# Altium project Board3.PrjPcb
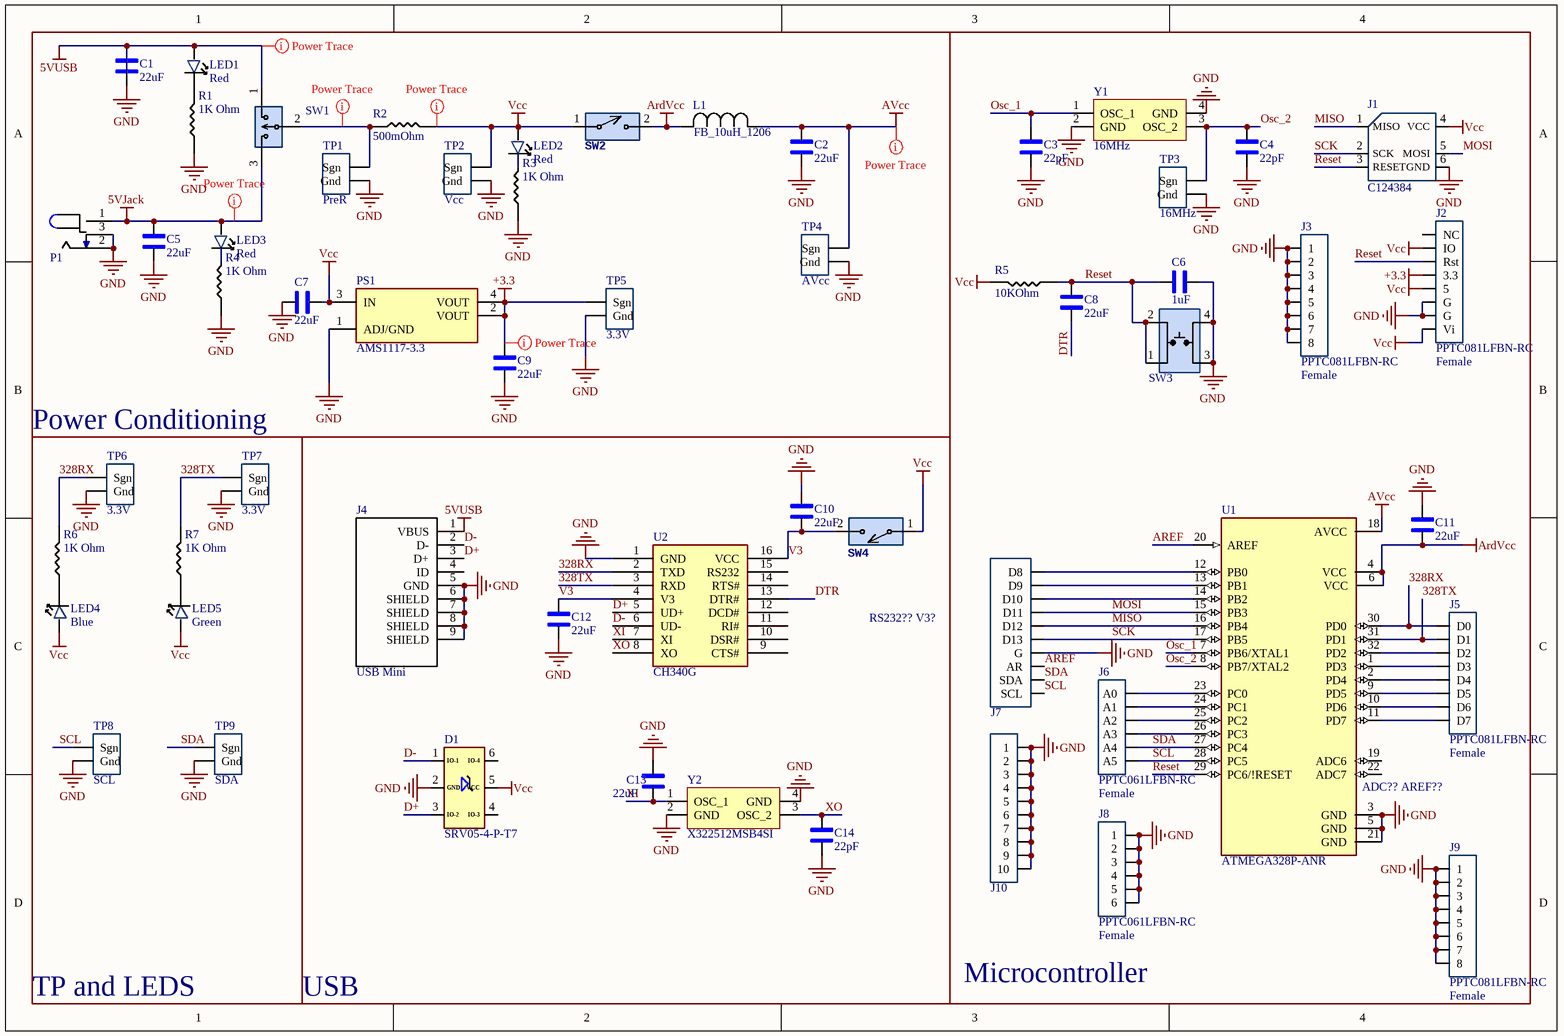
[diagram p0: Board3.SchDoc]
1 sheet, 57 parts. Net scope: global (net labels, ports and power ports of the same name join across sheets).
Board file: Board3.PcbDoc

## Sheet Board3.SchDoc
size A4; SheetNumber: 1; SheetTotal: 1

### Parts
C1  22uF  [1206_Passive_Capacitor]
C2  22uF  [1206_Passive_Capacitor]
C3  22pF  [1206_Passive_Capacitor]
C4  22pF  [1206_Passive_Capacitor]
C5  22uF  [1206_Passive_Capacitor]
C6  1uF  [1206_Passive_Capacitor]
C7  22uF  [1206_Passive_Capacitor]
C8  22uF  [1206_Passive_Capacitor]
C9  22uF  [1206_Passive_Capacitor]
C10  22uF  [1206_Passive_Capacitor]
C11  22uF  [1206_Passive_Capacitor]
C12  22uF  [1206_Passive_Capacitor]
C13  22uF  [1206_Passive_Capacitor]
C14  22pF  [1206_Passive_Capacitor]
D1  SRV05-4-P-T7  [TVS]
J1  LCSC Part#: C124384  [ICSP]  (hidden comment: NRPN032PAEN-RC)
J2  PPTC081LFBN-RC  value Female  [8_PIN_ARD-PWR_100MIL]
J3  PPTC081LFBN-RC  value Female  [8_PIN_100MIL - Female]
J4  USB Mini  [USB_MINI_B]
J5  PPTC081LFBN-RC  value Female  [8_PIN_ARD-DIG_100MIL]
J6  PPTC061LFBN-RC  value Female  [6_PIN_ARD-Analog_100mil]
J7  PPTC101LFBN-RC  [10_PIN_ARDUINO_100MIL]  (value not drawn)
J8  PPTC061LFBN-RC  value Female  [6_PIN_100MIL -Female]
J9  PPTC081LFBN-RC  value Female  [8_PIN_100MIL - Female]
J10  PPTC101LFBN-RC  [10_PIN_100MIL - Female]  (value not drawn)
L1  FB_10uH_1206  [AIML-1206_ABR-M]
LED1  Red  [LED_1206]
LED2  Red  [LED_1206]
LED3  Red  [LED_1206]
LED4  Blue  [LED_1206]
LED5  Green  [LED_1206]
P1  Power Jack  [Power_Jack]  (value not drawn)
PS1  AMS1117-3.3  [LDO]
R1  value 1K Ohm  [1206_Passive_Resitor]  (hidden comment: 1k)
R2  value 500mOhm  [1206_Passive_Resitor]  (hidden comment: 500m)
R3  value 1K Ohm  [1206_Passive_Resitor]  (hidden comment: 1k)
R4  value 1K Ohm  [1206_Passive_Resitor]  (hidden comment: 1k)
R5  value 10KOhm  [1206_Passive_Resitor]  (hidden comment: 10k)
R6  value 1K Ohm  [1206_Passive_Resitor]  (hidden comment: 1k)
R7  value 1K Ohm  [1206_Passive_Resitor]  (hidden comment: 1k)
SW1  PREC003SAAN-RC  [3_PIN_100mil]  (value not drawn)
SW2  SW_2Pin_100mil_Switch  [2Pin-Header-Conn]  (value not drawn)
SW3  TL3305AF160QG  [Switch_JLC]  (value not drawn)
SW4  SW_2Pin_100mil_Switch  [2Pin-Header-Conn]  (value not drawn)
TP1  PreR  [TP10x_Probe]
TP2  Vcc  [TP10x_Probe]
TP3  16MHz  [TP10x_Probe]
TP4  AVcc  [TP10x_Probe]
TP5  3.3V  [TP10x_Probe]
TP6  3.3V  [TP10x_Probe]
TP7  3.3V  [TP10x_Probe]
TP8  SCL  [TP10x_Probe]
TP9  SDA  [TP10x_Probe]
U1  ATMEGA328P-ANR  [ATMega328P]
U2  CH340G  [USB to serial]
Y1  value 16MHz  [Crystal resonator]  (hidden comment: X322516MLB4SI)
Y2  X322512MSB4SI  [Crystal resonator]

### Blocks framed on the sheet
Power Conditioning: C1 C2 C5 C7 C9 L1 LED1-LED3 P1 PS1 R1-R4 SW1 SW2 TP1 TP2 TP4 TP5
Microcontroller: C3 C4 C6 C8 C11 J1-J3 J5-J10 R5 SW3 TP3 U1 Y1
TP and LEDS: LED4 LED5 R6 R7 TP6-TP9
USB: C10 C12-C14 D1 J4 SW4 U2 Y2

### Nets
5VJack: C5.2 LED3.1 P1.1 SW1.3
5VUSB: C1.1 J4.1(VBUS) LED1.1 SW1.1
+3.3: C9.2 J2.4(3.3) PS1.2(VOUT) PS1.4(VOUT) TP5.1(Sgn)
ArdVcc: C11.2 L1.2 SW2.2 U1.4(VCC) U1.6(VCC)
AVcc: C2.2 L1.1 TP4.1(Sgn) U1.18(AVCC)
GND: C1.2 C2.1 C3.1 C4.1 C5.1 C6.1 C7.1 C9.1 C10.1 C11.1 C12.1 C13.2 C14.1 D1.2(GND) J1.6(GND) J2.6(G) J2.7(G) J3.1 J3.2 J3.3 J3.4 J3.5 J3.6 J3.7 J3.8 J4.5(GND) J4.6(SHIELD) J4.7(SHIELD) J4.8(SHIELD) J4.9(SHIELD) J7.4(G) J8.1 J8.2 J8.3 J8.4 J8.5 J8.6 J9.1 J9.2 J9.3 J9.4 J9.5 J9.6 J9.7 J9.8 J10.1 J10.2 J10.3 J10.4 J10.5 J10.6 J10.7 J10.8 J10.9 J10.10 P1.2 P1.3 PS1.1(ADJ/GND) R1.1 R3.1 R4.1 SW3.3 SW3.4 TP1.2(Gnd) TP2.2(Gnd) TP3.2(Gnd) TP4.2(Gnd) TP5.2(Gnd) TP6.2(Gnd) TP7.2(Gnd) TP8.2(Gnd) TP9.2(Gnd) U1.3(GND) U1.5(GND) U1.21(GND) U2.1(GND) Y1.2(GND) Y1.4(GND) Y2.2(GND) Y2.4(GND)
Vcc: C7.2 D1.5(VCC) J1.4(VCC) J2.2(IO) J2.5 J2.8(Vi) LED2.1 LED4.1 LED5.1 PS1.3(IN) R2.2 R5.2 SW2.1 SW4.1 TP2.1(Sgn)
328RX: J5.8(D0) R6.2 TP6.1(Sgn) U1.30(PD0) U2.2(TXD)
328TX: J5.7(D1) R7.2 TP7.1(Sgn) U1.31(PD1) U2.3(RXD)
AREF: J7.3(AR) U1.20(AREF)
D+: D1.3(IO-2) J4.3(D+) U2.5(UD+)
D-: D1.1(IO-1) J4.2(D-) U2.6(UD-)
DTR: C8.2 U2.13(DTR#)
MISO: J1.1(MISO) J7.6(D12) U1.16(PB4)
MOSI: J1.5(MOSI) J7.7(D11) U1.15(PB3)
Osc_1: C3.2 U1.7(PB6/XTAL1) Y1.1(OSC_1)
Osc_2: C4.2 TP3.1(Sgn) U1.8(PB7/XTAL2) Y1.3(OSC_2)
Reset: C6.2 C8.1 J1.3(RESET) J2.3(Rst) R5.1 SW3.1 SW3.2 U1.29(PC6/!RESET)
SCK: J1.2(SCK) J7.5(D13) U1.17(PB5)
SCL: J6.6(A5) J7.1(SCL) TP8.1(Sgn) U1.28(PC5)
SDA: J6.5(A4) J7.2(SDA) TP9.1(Sgn) U1.27(PC4)
V3: C10.2 C12.2 SW4.2 U2.4(V3) U2.16(VCC)
XI: C13.1 U2.7(XI) Y2.1(OSC_1)
XO: C14.2 U2.8(XO) Y2.3(OSC_2)
NetJ5_1: J5.1(D7) U1.11(PD7)
NetJ5_2: J5.2(D6) U1.10(PD6)
NetJ5_3: J5.3(D5) U1.9(PD5)
NetJ5_4: J5.4(D4) U1.2(PD4)
NetJ5_5: J5.5(D3) U1.1(PD3)
NetJ5_6: J5.6(D2) U1.32(PD2)
NetJ6_1: J6.1(A0) U1.23(PC0)
NetJ6_2: J6.2(A1) U1.24(PC1)
NetJ6_3: J6.3(A2) U1.25(PC2)
NetJ6_4: J6.4(A3) U1.26(PC3)
NetJ7_8: J7.8(D10) U1.14(PB2)
NetJ7_9: J7.9(D9) U1.13(PB1)
NetJ7_10: J7.10(D8) U1.12(PB0)
NetLED1_2: LED1.2 R1.2
NetLED2_2: LED2.2 R3.2
NetLED3_2: LED3.2 R4.2
NetLED4_2: LED4.2 R6.1
NetLED5_2: LED5.2 R7.1
NetR2_1: R2.1 SW1.2 TP1.1(Sgn)

Not connected (* = marked no-connect by the designer): D1 4(IO-3) 6(IO-4); J2 1(NC); J4 4(ID); U1 19(ADC6) 22(ADC7); U2 9(CTS#) 10(DSR#) 11(RI#) 12(DCD#) 14(RTS#) 15(RS232)

### Layout directives
rule Width Constraint [Pref Width = 20mil    Min Width = 10mil    Max Width = 100mil]: 5VJack, 5VUSB, +3.3, AVcc, NetR2_1, Vcc

### Notes on the sheet
- RS232?? V3?
- (near U1) ADC?? AREF??

### Library data of the parts
C1 C2 C5 C7-C13 = C_22uF_1206: 22uF ±10% 25V X5R 1206 Multilayer Ceramic Capacitors MLCC - SMD/SMT RoHS; MFR Part #: CL31A226KAHNNNE; Type: basic; LCSC Part#: C12891; Datasheet: https://datasheet.lcsc.com/lcsc/1811031514_Samsung-Electro-Mechanics-CL31A226KAHNNNE_C12891.pdf; Value: 22uF
C3 C4 C14 = C_22pF_1206: 22pF ±5% 1kV C0G 1206 Multilayer Ceramic Capacitors MLCC - SMD/SMT RoHS; MFR Part #: 1206CG220J102NT; Type: Extended; LCSC Part#: C313096; Datasheet: https://datasheet.lcsc.com/lcsc/1810311150_FH-Guangdong-Fenghua-Advanced-Tech-1206CG220J102NT_C313096.pdf; Value: 22pF
C6 = C_1uF_1206: MULTILAYER CERAMIC CAPACITORS MLCC - SMD/SMT 1UF 50V 1206 ROHS; MFR Part #: CL31B105KBHNNNE; Type: Basic; Digikey Link: https://www.digikey.com/product-detail/en/C1206C105M4RACTU/399-8150-1-ND/3471873/?itemSeq=304982366; LCSC Part#: C1848; Value: 1uF
D1 = D_TVS_Diode: TVS SOT-23-6 ROHS; Value: TVS DIODE 5.5V 6TSOP; Type: Basic; MFR Part #: SRV05-4-P-T7; LCSC Part#: C85364; Datasheet: https://datasheet.lcsc.com/szlcsc/ProTek-Devices-SRV05-4-P-T7_C85364.pdf
J1 = J_ICSP: Connector Header Through Hole 6 position 0.079" (2.00mm); Digikey Link: https://www.digikey.com/product-detail/en/NRPN032PAEN-RC/S5801-03-ND/804955/?itemSeq=304982355; MFR Part #: NRPN032PAEN-RC; Type: Extended
J2 = JF_8_PIN_FEMALE_ARD-Pwr: 8 Position Header Connector 0.100" (2.54mm) Through Hole Tin; Digikey Link: https://www.digikey.com/product-detail/en/PPTC081LFBN-RC/S7006-ND/810147/?itemSeq=304982354; MFR Part #: PPTC081LFBN-RC; Type: Extended; LCSC Part#: C27438
J3 J9 = JF_8_PIN_FEMALE: 8 Position Header Connector 0.100" (2.54mm) Through Hole Tin; Digikey Link: https://www.digikey.com/product-detail/en/PPTC081LFBN-RC/S7006-ND/810147/?itemSeq=304982354; MFR Part #: PPTC081LFBN-RC; Type: Extended; LCSC Part#: C27438
J4 = J_USB_B_Mini: Through Hole USB Connectors RoHS; MFR Part #: 920-462A2021D10102; Value: USB mini B; LCSC Part#: C46398; Datasheet: https://datasheet.lcsc.com/szlcsc/2103081233_Jing-Extension-of-the-Electronic-Co-920-462A2021D10102_C46398.pdf; Type: Extended
J5 = JF_8_PIN_FEMALE_ARD-Dig: 8 Position Header Connector 0.100" (2.54mm) Through Hole Tin; Digikey Link: https://www.digikey.com/product-detail/en/PPTC081LFBN-RC/S7006-ND/810147/?itemSeq=304982354; MFR Part #: PPTC081LFBN-RC; Type: Extended; LCSC Part#: C27438
J6 = JF_6_PIN_FEMALE_ARD-Anolog: 6 Position Header Connector 0.100" (2.54mm) Through Hole Tin; Digikey Link: https://www.digikey.com/product-detail/en/PPTC061LFBN-RC/S7004-ND/810145/?itemSeq=304982353; MFR Part #: PPTC061LFBN-RC; LCSC Part#: C40877; Type: Extended
J7 = JF_10_PIN_FEMALE_ARDUINO: 10 Position Header Connector 0.100" (2.54mm) Through Hole Tin; Value: Female; Digikey Link: https://www.digikey.com/product-detail/en/PPTC101LFBN-RC/S7008-ND/810149/?itemSeq=304982352; MFR Part #: PPTC101LFBN-RC; LCSC Part#: C225507; Type: Extended
J8 = JF_6_PIN_FEMALE: 6 Position Header Connector 0.100" (2.54mm) Through Hole Tin; Digikey Link: https://www.digikey.com/product-detail/en/PPTC061LFBN-RC/S7004-ND/810145/?itemSeq=304982353; MFR Part #: PPTC061LFBN-RC; LCSC Part#: C40877; Type: Extended
J10 = JF_10_PIN_FEMALE_: 10 Position Header Connector 0.100" (2.54mm) Through Hole Tin; Value: Female; Digikey Link: https://www.digikey.com/product-detail/en/PPTC101LFBN-RC/S7008-ND/810149/?itemSeq=304982352; MFR Part #: PPTC101LFBN-RC; LCSC Part#: C225507; Type: Extended
L1 = FB_10uH_1206: 25mA 10uH ±10% 800mΩ 1206  Inductors (SMD) ROHS; Mfr_Name: FH (Guangdong Fenghua Advanced Tech); MFR PART #: CMI321609X100KT; Type: Basic; LCSC PART#: C1051; DataSheet: https://datasheet.lcsc.com/lcsc/1810311314_FH--Guangdong-Fenghua-Advanced-Tech-CMI321609X100KT_C1051.pdf
LED1-LED3 = LED_RED_1206: Red 621~631nm 1206 Light Emitting Diodes (LED) RoHS; MFR Part #: 15-21/R6C-FQ1R1B/2T; Type: Extended; LCSC Part#: C93133; Datasheet: https://datasheet.lcsc.com/szlcsc/1811151241_Everlight-Elec-15-21-R6C-FQ1R1B-2T_C93133.pdf; Value: Red
LED4 = LED_BLUE_1206: blue 1206  Light Emitting Diodes (LED) ROHS; MFR Part #: NCD1206B1; Type: Extended; LCSC Part#: C130717; Datasheet: https://datasheet.lcsc.com/lcsc/2008201033_Foshan-NationStar-Optoelectronics-NCD1206B1_C130717.pdf; Value: Blue
LED5 = LED_GREEN_1206: Green 513~528nm 1206 Light Emitting Diodes (LED) RoHS; MFR Part #: SZYY1206G; Type: Extended; LCSC Part#: C434439; Datasheet: https://datasheet.lcsc.com/lcsc/2006301532_Yongyu-Photoelectric-SZYY1206G_C434439.pdf; Value: Green
P1 = P_Power Jack: Power Barrel Connector Jack 2.10mm ID (0.083"), 5.50mm OD (0.217") Through Hole, Right Angle; MFR Part #: PJ-102A; Value: CONN PWR JACK 2X5.5MM SOLDER; Digikey Link: https://www.digikey.com/product-detail/en/PJ-102A/CP-102A-ND/275425/?itemSeq=304982367; LCSC Part#: C136744; Type: Extended
PS1 = PS_AMS_LDO_3v3: LOW DROPOUT REGULATORS(LDO) POSITIVE FIXED 1.3V @ 800MA 15V 3.3V 1A SOT-223 ROHS; Value: IC REG LINEAR 3.3V 800MA SOT223; MFR Part #: AMS1117-3.3; LCSC Part#: C6186; Type: Basic
R1 R3 R4 R6 R7 = R_1K_1206: CHIP RESISTOR - SURFACE MOUNT 1KOHMS ±1% 1/4W 1206 ROHS; MFR Part #: RNCP1206FTD1K00CT; Digikey Link: https://www.digikey.com/product-detail/en/RNCP1206FTD1K00/RNCP1206FTD1K00CT-ND/2240675/?itemSeq=304982373; LCSC Part#: C4410; Type: Basic
R2 = R_500mOhm_1206: Resistors/Shunt 250mW 500mΩ ±800ppm/℃ ±5% 1206  Current Sense  Resistors ROHS; MFR Part #: 1206W4J050KT5E; Datasheet: https://datasheet.lcsc.com/lcsc/1810301438_UNI-ROYAL-Uniroyal-Elec-1206W4J050KT5E_C247433.pdf; LCSC Part#: C247433; Type: Extended
R5 = R_10KOhm_1206: 10 kOhms ±5% 0.25W, 1/4W Chip Resistor 1206 (3216 Metric) Automotive AEC-Q200 Thick Film; MFR Part #: RMCF1206FT10K0; Digikey Link: https://www.digikey.com/en/products/detail/stackpole-electronics-inc/RMCF1206FT10K0/1759669; LCSC Part#: C17902; Type: Basic
SW1 = SW_3Pin_100mil_Switch: Connector Header Through Hole 3 position 0.100" (2.54mm); Value: CONN HEADER VERT 3POS 2.54MM; Digikey Link: https://www.digikey.com/product-detail/en/PREC003SAAN-RC/S1012EC-03-ND/2774851/?itemSeq=304982371; MFR Part #: PREC003SAAN-RC; Type: Extended; LCSC Part#: C49257
SW2 SW4 = SW_2Pin_100mil_Switch: 2Pin Header; LCSC Part#: C124375; Type: Extended
SW3 = SW_Push_Button_JLC: Tactile Switch SPST-NO Top Actuated Surface Mount; MFR Part #: KH-4.5X4.5X4.3H-STM; LCSC Part#: C2837550; Type: Extended; DataSheet: https://datasheet.lcsc.com/lcsc/2106081532_Shenzhen-Kinghelm-Elec-KH-4.5X4.5X4.3H-STM_C2837550.pdf
TP1-TP9 = TP_10x_Probe: Test Point 300 mil centers
U1 = U_ATMega328P: AVR AVR® ATmega Microcontroller IC 8-Bit 20MHz 32KB (16K x 16) FLASH 32-TQFP (7x7); MFR Part #: ATMEGA328P-AU; Value: IC MCU 8BIT 32KB FLASH 32TQFP; Digikey Link: https://www.digikey.com/product-detail/en/ATMEGA328P-ANR/ATMEGA328P-ANRCT-ND/2774230/?itemSeq=304982365; LCSC Part#: C14877; Type: Basic
U2 = U_USBtoSerial: Transceiver USB 2.0 2Mbps SOP-16_150mil USB ICs RoHS; Datasheet: https://datasheet.lcsc.com/lcsc/2008191806_WCH-Jiangsu-Qin-Heng-CH340G_C14267.pdf; LCSC Part#: C14267; MFR Part #: CH340G; Type: Basic; Value: USB to Serial
Y1 = X_16Mhz_Res: ±10ppm 16000000Hz -40℃~85℃ 贴片无源晶振 60Ω 9pF SMD3225-4P Crystals ROHS; LCSC Part#: C13738; MFR Part #: X322516MLB4SI; Type: Basic
Y2 = X_12MHz_Res: SMD Crystal Resonators 12MHz ±10ppm SMD-3225_4P RoHS; LCSC Part#: C9002; MFR Part #: X322512MSB4SI; Value: 12MHz; Type: Basic; Datasheet: https://datasheet.lcsc.com/szlcsc/Yangxing-Tech-X322512MSB4SI_C9002.pdf